# Altium project formation PCB.PrjPcb
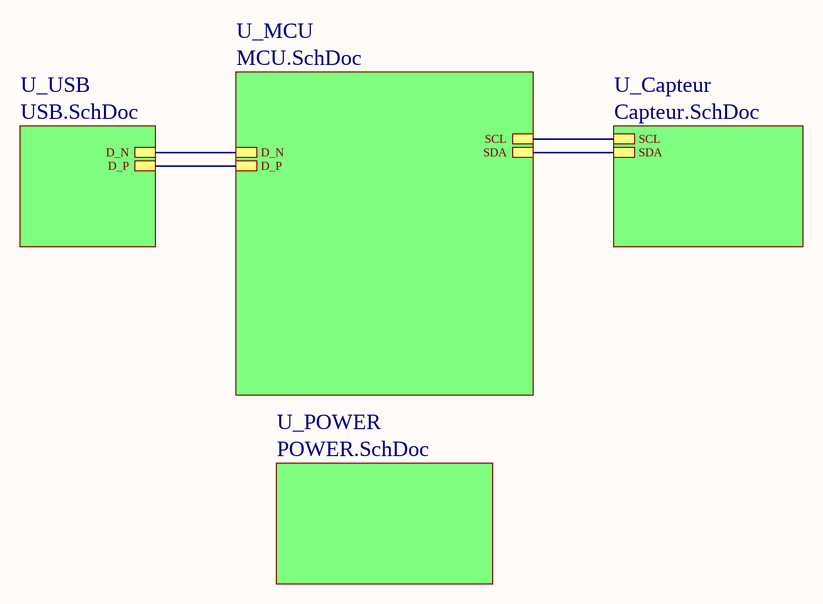
[diagram p0: main.SchDoc]
5 sheets, 22 parts. Net scope: hierarchical (ports join the sheet entries above them; power ports are global).
Board file: PCB_Formation__ .PcbDoc
Sheets:
  main.SchDoc
    U_MCU = MCU.SchDoc
    U_Capteur = Capteur.SchDoc
    U_USB = USB.SchDoc
    U_POWER = POWER.SchDoc

## Sheet main.SchDoc
size A4; SheetNumber: 1; SheetTotal: 5

### Sub-sheets
U_Capteur = Capteur.SchDoc: SCL, SDA
U_MCU = MCU.SchDoc: SDA, SCL, D_N, D_P
U_POWER = POWER.SchDoc: no entries
U_USB = USB.SchDoc: D_N, D_P

### Nets
D_N: sheet U_MCU/D_N, sheet U_USB/D_N
D_P: sheet U_MCU/D_P, sheet U_USB/D_P
SCL: sheet U_MCU/SCL, sheet U_Capteur/SCL
SDA: sheet U_MCU/SDA, sheet U_Capteur/SDA

## Sheet MCU.SchDoc
size A4; SheetNumber: 2; SheetTotal: 5
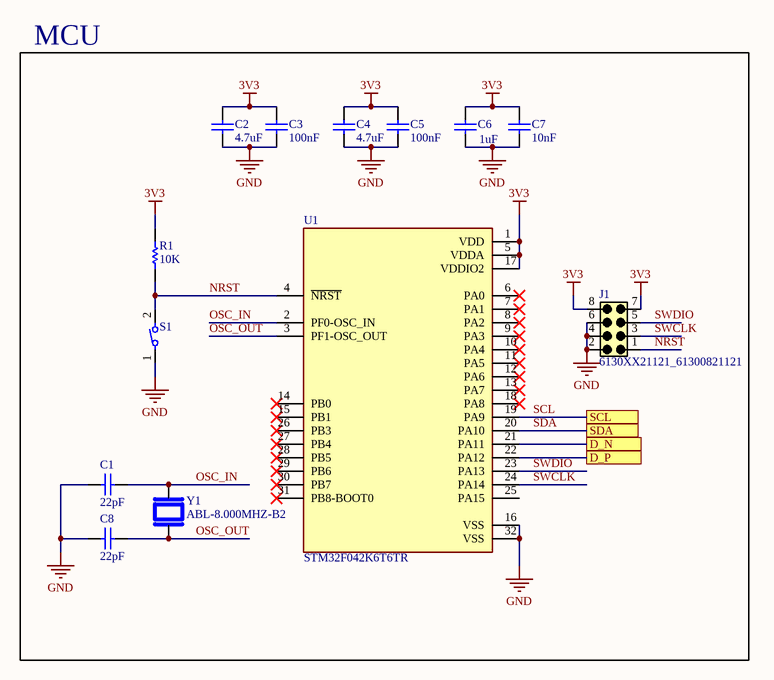
[diagram p1: MCU.SchDoc]

### Parts
C1  22pF  [CAP_0402L]
C2  4.7uF  [CAP_0402L]
C3  100nF  [CAP_0402L]
C4  4.7uF  [CAP_0402L]
C5  100nF  [CAP_0402L]
C6  1uF  [CAP_0402L]
C7  10nF  [CAP_0402L]
C8  22pF  [CAP_0402L]
J1  6130XX21121_61300821121  [61300821121]
R1  10K  [RES_0402N]
S1  434123025816  [434123025816]  (value not drawn)
U1  STM32F042K6T6TR  [QFP80P900X900X160-32N]
Y1  ABL-8.000MHZ-B2  [XTAL_HC49P488W46L1150T500H350]

### Blocks framed on the sheet
MCU: C1-C8 J1 R1 S1 U1 Y1

### Ports
D_N, D_P, SCL, SDA

### Nets
3V3: C2.2 C3.2 C4.2 C5.2 C6.2 C7.2 J1.7 J1.8 R1.2 U1.1(VDD) U1.5(VDDA) U1.17(VDDIO2)
GND: C1.1 C2.1 C3.1 C4.1 C5.1 C6.1 C7.1 C8.1 J1.2 J1.4 J1.6 S1.1 U1.16(VSS) U1.32(VSS)
D_N: U1.21(PA11) ; port D_N
D_P: U1.22(PA12) ; port D_P
NRST: J1.1 R1.1 S1.2 U1.4(~{NRST})
OSC_IN: C1.2 U1.2(PF0-OSC_IN) Y1.2
OSC_OUT: C8.2 U1.3(PF1-OSC_OUT) Y1.1
SCL: U1.19(PA9) ; port SCL
SDA: U1.20(PA10) ; port SDA
SWCLK: J1.3 U1.24(PA14)
SWDIO: J1.5 U1.23(PA13)

Not connected (* = marked no-connect by the designer): U1 6(PA0)* 7(PA1)* 8(PA2)* 9(PA3)* 10(PA4)* 11(PA5)* 12(PA6)* 13(PA7)* 14(PB0)* 15(PB1)* 18(PA8)* 25(PA15) 26(PB3)* 27(PB4)* 28(PB5)* 29(PB6)* 30(PB7)* 31(PB8-BOOT0)*

### Library data of the parts
C1 C8 = CAP CER 22pF: CAP CER 22pF 16V X7R 10% 0402; Value: 100nF; Capacitor Type: Ceramic; Mount: Surface Mount; RoHS: Yes; Tolerance: 10%; Case/Package: 0402; Construction: Flat; Width: 0.02inch; Voltage Rating: 16V; Packaging: Tape and Reel; Series: C; Thickness: 0.022inch; Voltage Rating (DC): 16V; Capacitance: 100nF; Dielectric Material: Ceramic; Package Quantity: 50000; Height: 0.5mm; Dielectric: X7R; Depth: 0.5mm; Length: 1mm; Max Operating Temperature: 125°C; Min Operating Temperature: -55°C
C2 C4 = CAP CER 4.7uF: CAP CER 4.7uF 16V X7R 10% 0402; Value: 100nF; Capacitor Type: Ceramic; Mount: Surface Mount; RoHS: Yes; Tolerance: 10%; Case/Package: 0402; Construction: Flat; Width: 0.02inch; Voltage Rating: 16V; Packaging: Tape and Reel; Series: C; Thickness: 0.022inch; Voltage Rating (DC): 16V; Capacitance: 100nF; Dielectric Material: Ceramic; Package Quantity: 50000; Height: 0.5mm; Dielectric: X7R; Depth: 0.5mm; Length: 1mm; Max Operating Temperature: 125°C; Min Operating Temperature: -55°C
C3 C5 C7 = CAP CER 100nF: CAP CER 100nF 16V X7R 10% 0402; Capacitor Type: Ceramic; Mount: Surface Mount; RoHS: Yes; Tolerance: 10%; Value: 100nF; Case/Package: 0402; Construction: Flat; Width: 0.02inch; Voltage Rating: 16V; Packaging: Tape and Reel; Series: C; Thickness: 0.022inch; Voltage Rating (DC): 16V; Capacitance: 100nF; Dielectric Material: Ceramic; Package Quantity: 50000; Height: 0.5mm; Dielectric: X7R; Depth: 0.5mm; Length: 1mm; Max Operating Temperature: 125°C; Min Operating Temperature: -55°C
C6 = CAP CER 100nF_1: CAP CER 100nF 16V X7R 10% 0402; Capacitor Type: Ceramic; Mount: Surface Mount; RoHS: Yes; Tolerance: 10%; Value: 100nF; Case/Package: 0402; Construction: Flat; Width: 0.02inch; Voltage Rating: 16V; Packaging: Tape and Reel; Series: C; Thickness: 0.022inch; Voltage Rating (DC): 16V; Capacitance: 100nF; Dielectric Material: Ceramic; Package Quantity: 50000; Height: 0.5mm; Dielectric: X7R; Depth: 0.5mm; Length: 1mm; Max Operating Temperature: 125°C; Min Operating Temperature: -55°C
J1 = 6130XX21121_61300821121: Connector Header Through Hole 8 position 0.100 (2.54mm); MF: Wurth Electronics; SnapEDA_Link: https://www.snapeda.com/parts/61300821121/Wurth+Electronics/view-part/?ref=snap; Package: None; Value: *; MP: 61300821121; Check_prices: https://www.snapeda.com/parts/61300821121/Wurth+Electronics/view-part/?ref=eda
R1 = RES SMD 10K: RES SMD 10K OHM 1% 1/16W 0402; Value: 0; Working Voltage: 50V; Temperature Coefficient: 100ppm/°C; Power Rating: 62.5mW; Resistance: 10kR; Lead Free: Lead Free; Height: 0.32mm; RoHS: Yes; Military Standard: Not; Lead Pitch: 0.2mm; Number of Terminations: 2; Case Code (Metric): 1005; REACH SVHC: No SVHC; Composition: Thick Film; Max Operating Temperature: 155°C; Tolerance: 1%; Min Operating Temperature: -55°C; Termination: SMD/SMT; Depth: 0.5mm; Width: 0.5mm; Voltage Rating: 50V; Number of Pins: 2; Length: 1mm; Case Code (Imperial): 0402; Case/Package: 0402; Mount: SMD; Packaging: Tape and Reel; Voltage Rating (DC): 50V
S1 = 434123025816: Tactile Switch SPST-NO Top Actuated Surface Mount; MF: WÃ¼rth Elektronik; SnapEDA_Link: https://www.snapeda.com/parts/434123025816/W%25C3%25BCrth+Elektronik+Midcom/view-part/?ref=snap; Package: None; Value: *; MP: 434123025816; Check_prices: https://www.snapeda.com/parts/434123025816/W%25C3%25BCrth+Elektronik+Midcom/view-part/?ref=eda
U1 = STM32F042K6T6TR: ARMÂ® CortexÂ®-M0 STM32F0 Microcontroller IC 32-Bit Single-Core 48MHz 32KB (32K x 8) FLASH 32-LQFP (7x7); MF: STMicroelectronics; SnapEDA_Link: https://www.snapeda.com/parts/STM32F042K6T6TR/STMicroelectronics/view-part/?ref=snap; Package: LQFP-32 STMicroelectronics; Value: *; MP: STM32F042K6T6TR; Check_prices: https://www.snapeda.com/parts/STM32F042K6T6TR/STMicroelectronics/view-part/?ref=eda
Y1 = ABL-8.000MHZ-B2: HC/49US (AT49) MICROPROCESSOR CRYSTAL; MF: Abracon; Check_prices: https://www.snapeda.com/parts/ABL-8.000MHZ-B2/Abracon+LLC/view-part/?ref=eda; Package: HC-49/US ABRACON; MP: ABL-8.000MHZ-B2; Value: *; SnapEDA_Link: https://www.snapeda.com/parts/ABL-8.000MHZ-B2/Abracon+LLC/view-part/?ref=snap; Availability: In Stock; Price: None; Purchase-URL: https://pricing.snapeda.com/search/part/ABL-8.000MHZ-B2/?ref=eda

## Sheet Capteur.SchDoc
size A4; SheetNumber: 3; SheetTotal: 5
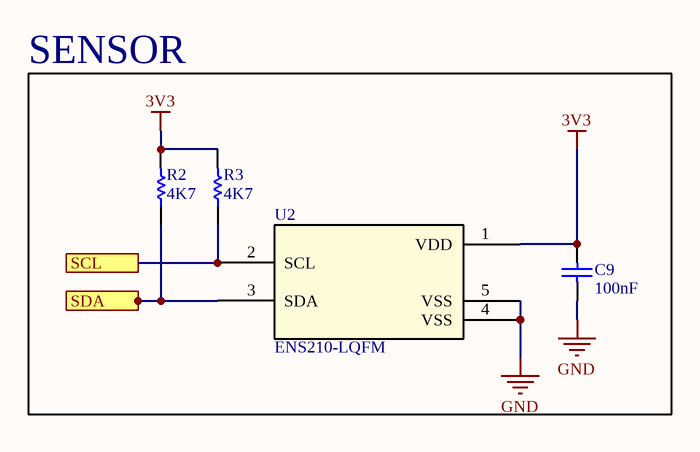
[diagram p2: Capteur.SchDoc]

### Parts
C9  100nF  [CAP_0402L]
R2  4K7  [RES_0402N]
R3  4K7  [RES_0402N]
U2  ENS210-LQFM  [SON-04-ENS210_2X2_AMS]

### Blocks framed on the sheet
SENSOR: C9 R2 R3 U2

### Ports
SCL, SDA

### Nets
3V3: C9.2 R2.2 R3.2 U2.1(VDD)
GND: C9.1 U2.4(VSS) U2.5(VSS)
SCL: R3.1 U2.2(SCL) ; port SCL
SDA: R2.1 U2.3(SDA) ; port SDA

### Library data of the parts
C9 = CAP CER 100nF: as C3 on sheet MCU; Mount: Surface Mount; RoHS: Yes; Tolerance: 10%; Value: 100nF; Case/Package: 0402; Construction: Flat; Width: 0.02inch; Voltage Rating: 16V; Packaging: Tape and Reel; Series: C; Thickness: 0.022inch; Voltage Rating (DC): 16V; Capacitance: 100nF; Dielectric Material: Ceramic; Package Quantity: 50000; Height: 0.5mm; Dielectric: X7R; Depth: 0.5mm; Length: 1mm; Max Operating Temperature: 125°C; Min Operating Temperature: -55°C
R2 R3 = Res_4K7: RES SMD 4.7K OHM 1% 1/16W 0402; Value: 0; Working Voltage: 50V; Temperature Coefficient: 100ppm/°C; Power Rating: 62.5mW; Resistance: 10kR; Lead Free: Lead Free; Height: 0.32mm; RoHS: Yes; Military Standard: Not; Lead Pitch: 0.2mm; Number of Terminations: 2; Case Code (Metric): 1005; REACH SVHC: No SVHC; Composition: Thick Film; Max Operating Temperature: 155°C; Tolerance: 1%; Min Operating Temperature: -55°C; Termination: SMD/SMT; Depth: 0.5mm; Width: 0.5mm; Voltage Rating: 50V; Number of Pins: 2; Length: 1mm; Case Code (Imperial): 0402; Case/Package: 0402; Mount: SMD; Packaging: Tape and Reel; Voltage Rating (DC): 50V
U2 = ENS210-LQFM: Description; Manufacturer_Name: ams OSRAM; Copyright: Copyright (C) 2025 Ultra Librarian. All rights reserved.; Manufacturer_Part_Number: ENS210-LQFM; RefDes: RefDes; Type: Type

## Sheet USB.SchDoc
size A4; SheetNumber: 4; SheetTotal: 5
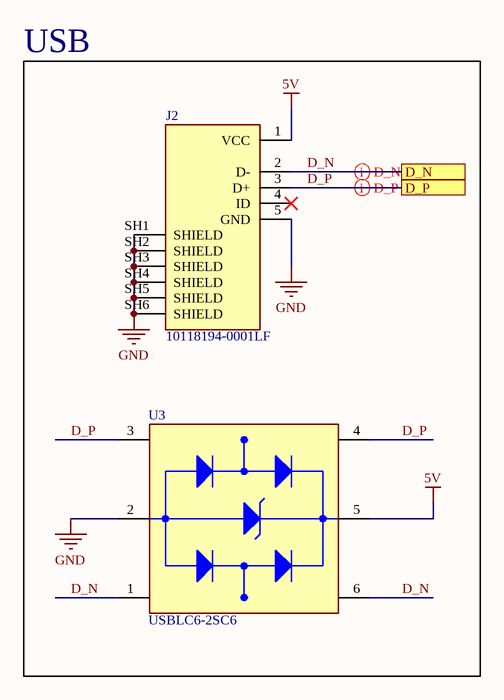
[diagram p3: USB.SchDoc]

### Parts
J2  10118194-0001LF  [AMPHENOL_10118194-0001LF]
U3  USBLC6-2SC6  [SOT95P280X145-6N]

### Blocks framed on the sheet
USB: J2 U3

### Ports
D_N, D_P

### Nets
5V: J2.1(VCC) U3.5(VBUS)
GND: J2.5(GND) J2.SH1(SHIELD) J2.SH2(SHIELD) J2.SH3(SHIELD) J2.SH4(SHIELD) J2.SH5(SHIELD) J2.SH6(SHIELD) U3.2(GND)
D_N: J2.2(D-) U3.1(I/O1_IN) U3.6(I/O1_OUT) ; port D_N
D_P: J2.3(D+) U3.3(I/O2_IN) U3.4(I/O2_OUT) ; port D_P

Not connected (* = marked no-connect by the designer): J2 4(ID)*

### Layout directives
differential pair: D_N, D_P

### Library data of the parts
J2 = 10118194-0001LF: Micro USB, Input Output Connectors, B TYPE RECEPTACLE with flange; MF: Amphenol ICC; SnapEDA_Link: https://www.snapeda.com/parts/10118194-0001LF/Amphenol+FCI/view-part/?ref=snap; Package: None; Value: *; MP: 10118194-0001LF; Check_prices: https://www.snapeda.com/parts/10118194-0001LF/Amphenol+FCI/view-part/?ref=eda
U3 = USBLC6-2SC6: 17V Clamp 5A (8/20Âµs) Ipp Tvs Diode Surface Mount SOT-23-6; MF: STMicroelectronics; Value: *; SnapEDA_Link: https://www.snapeda.com/parts/USBLC6-2SC6/STMicroelectronics/view-part/?ref=snap; Check_prices: https://www.snapeda.com/parts/USBLC6-2SC6/STMicroelectronics/view-part/?ref=eda; Purchase-URL: https://pricing.snapeda.com/search/part/USBLC6-2SC6/?ref=eda; Price: None; Availability: In Stock; Package: SOT-23-6 STMicroelectronics; MP: USBLC6-2SC6

## Sheet POWER.SchDoc
size A4; SheetNumber: 5; SheetTotal: 5
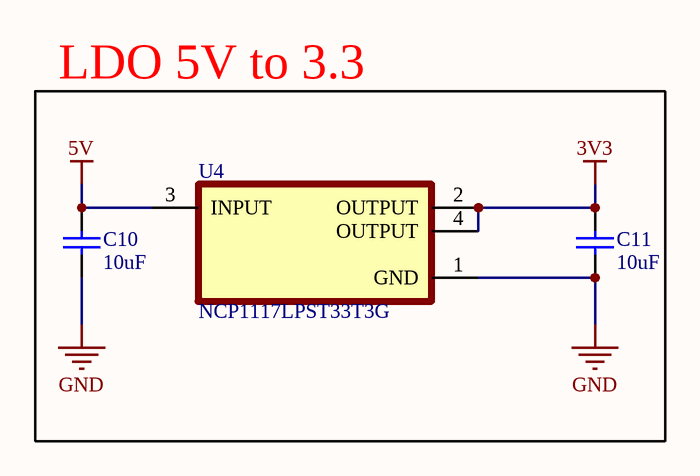
[diagram p4: POWER.SchDoc]

### Parts
C10  10uF  [CAP_0402L]
C11  10uF  [CAP_0402L]
U4  NCP1117LPST33T3G  [SOT230P700X175-4N]

### Blocks framed on the sheet
LDO 5V to 3.3: C10 C11 U4

### Nets
3V3: C11.2 U4.2(OUTPUT) U4.4(OUTPUT)
5V: C10.2 U4.3(INPUT)
GND: C10.1 C11.1 U4.1(GND)

### Library data of the parts
C10 C11 = CAP CER 10µF: CAP CER 10µF 16V X7R 10% 0402; Value: 100nF; Capacitor Type: Ceramic; Mount: Surface Mount; RoHS: Yes; Tolerance: 10%; Case/Package: 0402; Construction: Flat; Width: 0.02inch; Voltage Rating: 16V; Packaging: Tape and Reel; Series: C; Thickness: 0.022inch; Voltage Rating (DC): 16V; Capacitance: 100nF; Dielectric Material: Ceramic; Package Quantity: 50000; Height: 0.5mm; Dielectric: X7R; Depth: 0.5mm; Length: 1mm; Max Operating Temperature: 125°C; Min Operating Temperature: -55°C
U4 = NCP1117LPST33T3G: Linear Voltage Regulator IC Positive Fixed 1 Output 1A SOT-223; MF: ON Semiconductor; SnapEDA_Link: https://www.snapeda.com/parts/NCP1117LPST33T3G/Onsemi/view-part/?ref=snap; Package: SOT-223-4 ON Semiconductor; Value: *; MP: NCP1117LPST33T3G; Check_prices: https://www.snapeda.com/parts/NCP1117LPST33T3G/Onsemi/view-part/?ref=eda

## Nets that join several sheets
3V3: MCU (12 pins), Capteur (C9.2 R2.2 R3.2 U2.1), POWER (C11.2 U4.2 U4.4)
5V: USB (J2.1 U3.5), POWER (C10.2 U4.3)
GND: MCU (14 pins), Capteur (C9.1 U2.4 U2.5), USB (8 pins), POWER (C10.1 C11.1 U4.1)
D_N: MCU (U1.21), USB (J2.2 U3.1 U3.6)
D_P: MCU (U1.22), USB (J2.3 U3.3 U3.4)
SCL: MCU (U1.19), Capteur (R3.1 U2.2)
SDA: MCU (U1.20), Capteur (R2.1 U2.3)